# EAGLE design ATEM GPI-Tally Breakout Board (EAGLE 6.1)
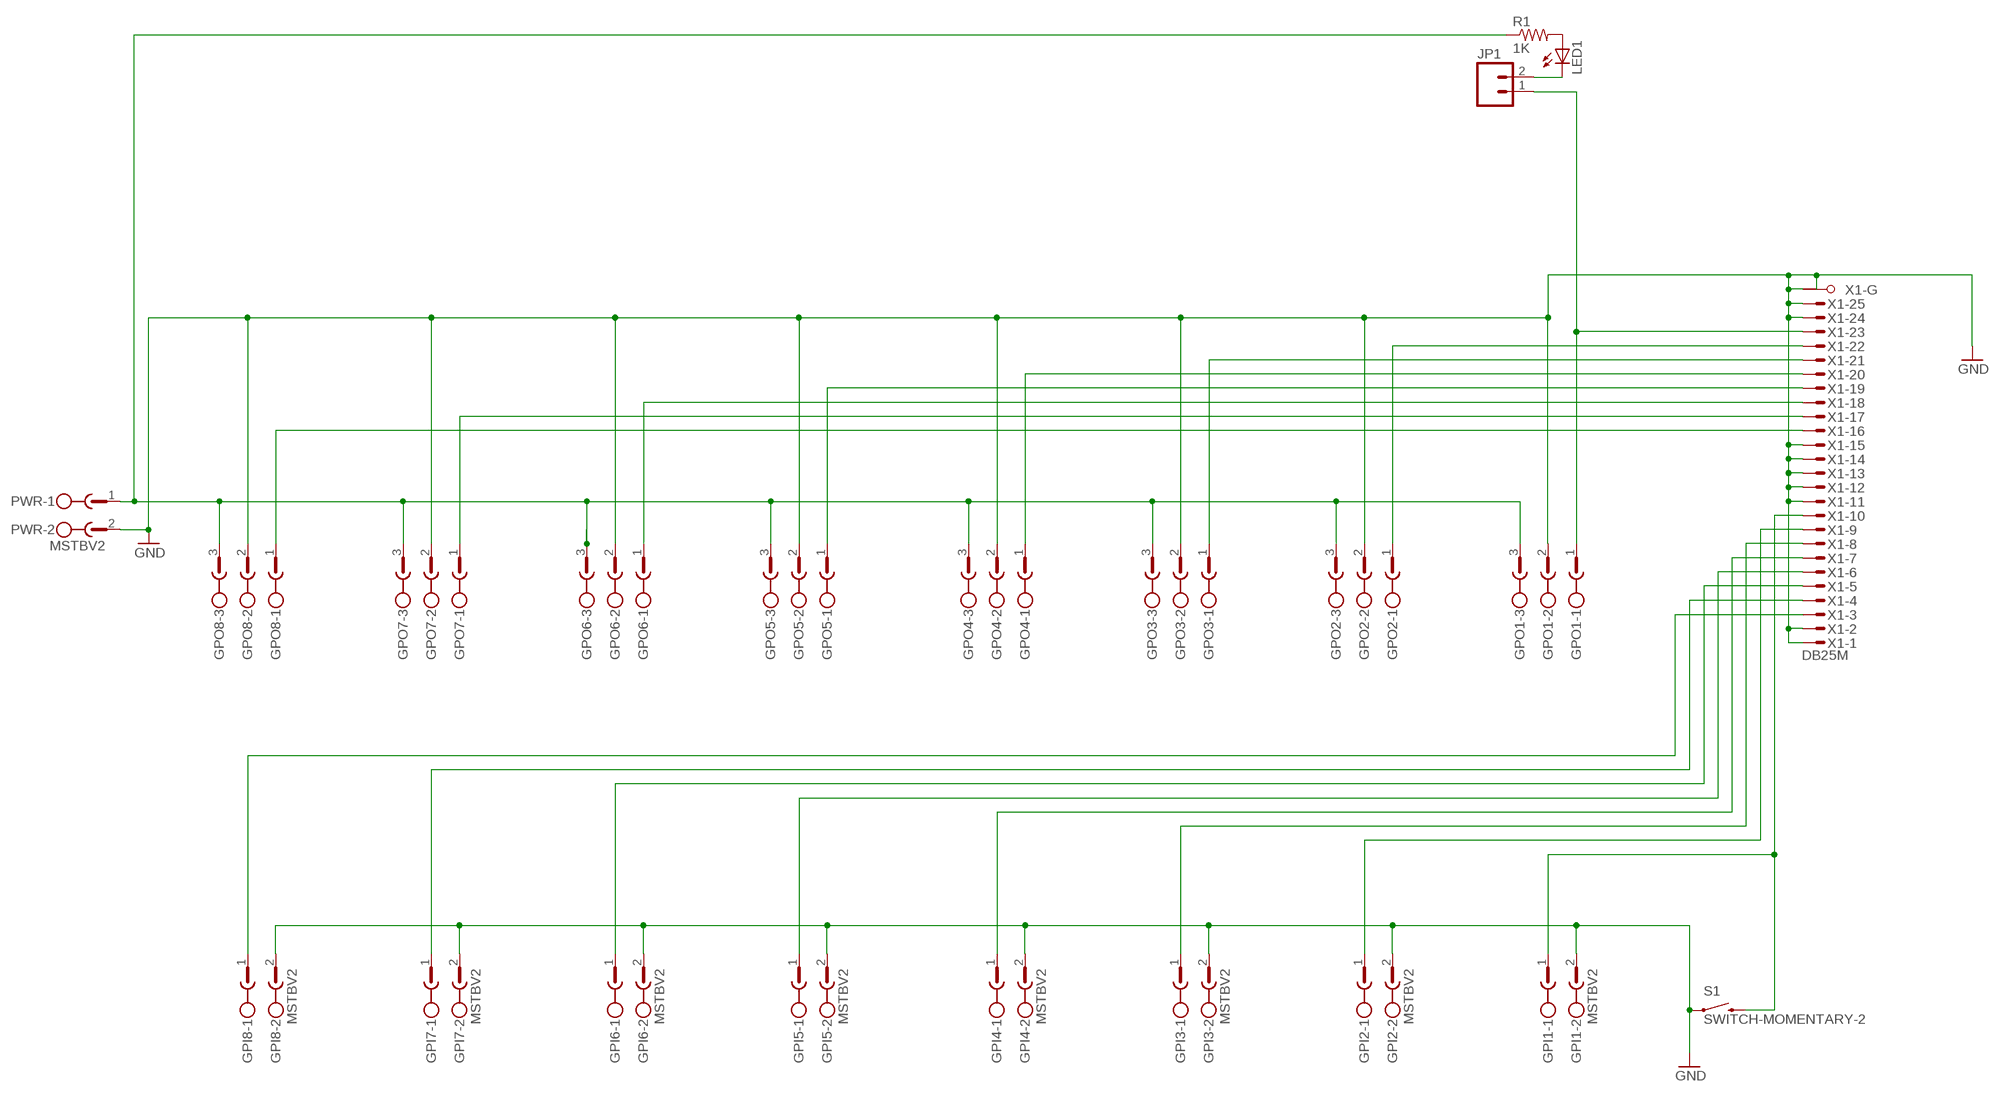
[diagram p0: schematic, sheet 1]

## Parts
GPI1  MSTBV2  [MSTBV2]
GPI2  MSTBV2  [MSTBV2]
GPI3  MSTBV2  [MSTBV2]
GPI4  MSTBV2  [MSTBV2]
GPI5  MSTBV2  [MSTBV2]
GPI6  MSTBV2  [MSTBV2]
GPI7  MSTBV2  [MSTBV2]
GPI8  MSTBV2  [MSTBV2]
GPO1  CON1  MSTBV3  [MSTBV3]
GPO2  CON1  MSTBV3  [MSTBV3]
GPO3  CON1  MSTBV3  [MSTBV3]
GPO4  CON1  MSTBV3  [MSTBV3]
GPO5  CON1  MSTBV3  [MSTBV3]
GPO6  CON1  MSTBV3  [MSTBV3]
GPO7  CON1  MSTBV3  [MSTBV3]
GPO8  CON1  MSTBV3  [MSTBV3]
JP1  M02LOCK  [1X02_LOCK]
LED1  LED5MM  [LED5MM]
PWR  MSTBV2  [MSTBV2]
R1  1K  RESISTORPTH-1/4W  [AXIAL-0.4]
S1  SWITCH-MOMENTARY-2  [TACTILE_SWITCH_TALL]
X1  DB25M  M25HPS  [M25HP]

## Nets
GND [PWR]: GPI1.2 GPI2.2 GPI3.2 GPI4.2 GPI5.2 GPI6.2 GPI7.2 GPI8.2 GPO1.2 GPO2.2 GPO3.2 GPO4.2 GPO5.2 GPO6.2 GPO7.2 GPO8.2 PWR.2 S1.A2 X1.1(-1:M) X1.2(-2:M) X1.11(-11:M) X1.12(-12:M) X1.13(-13:M) X1.14(-14:M) X1.15(-15:M) X1.24(-24:M) X1.25(-25:M) X1.G1(-G:G1) X1.G2(-G:G2)
N$1 [RELAY LINES]: GPO1.1 JP1.1 X1.23(-23:M)
N$2: JP1.2 LED1.K(C)
N$3: LED1.A R1.P$2
N$6 [RELAY LINES]: GPO2.1 X1.22(-22:M)
N$10 [RELAY LINES]: GPO3.1 X1.21(-21:M)
N$14 [RELAY LINES]: GPO4.1 X1.20(-20:M)
N$18 [RELAY LINES]: GPO5.1 X1.19(-19:M)
N$22 [RELAY LINES]: GPO6.1 X1.18(-18:M)
N$26 [RELAY LINES]: GPO7.1 X1.17(-17:M)
N$30 [RELAY LINES]: GPO8.1 X1.16(-16:M)
N$49 [INput lines]: GPI1.1 S1.B2 X1.10(-10:M)
N$55 [INput lines]: GPI5.1 X1.6(-6:M)
N$60 [INput lines]: GPI2.1 X1.9(-9:M)
N$61 [INput lines]: GPI3.1 X1.8(-8:M)
N$62 [INput lines]: GPI4.1 X1.7(-7:M)
N$64 [INput lines]: GPI6.1 X1.5(-5:M)
N$65 [INput lines]: GPI7.1 X1.4(-4:M)
N$66 [INput lines]: GPI8.1 X1.3(-3:M)
N$75 [RELAY LINES]: GPO1.3 GPO2.3 GPO3.3 GPO4.3 GPO5.3 GPO6.3 GPO7.3 GPO8.3 PWR.1 R1.P$1

## Library data of the parts
GPI1-GPI8 PWR = con-phoenix-508:MSTBV2: PHOENIX; MPN: MSTBV 2,5/2-GF-5.08; OC_FARNELL: 1792792; OC_NEWARK: 69R9845
GPO1-GPO8 = con-phoenix-508:MSTBV3: PHOENIX; MPN: MSTBV 2,5/3-GF-5.08; OC_FARNELL: 1792793; OC_NEWARK: 69R9846
JP1 = SparkFun:M02: Header 2 Standard 2-pin 0.1" header. Use with straight break away headers (SKU : PRT-00116), right angle break away headers (PRT-00553), swiss pins (PRT-00743), machine pins (PRT-00117), and female headers (PRT-00115). Molex polarized connector foot print use with SKU : PRT-08233 with associated crimp pins and housings.
LED1 = SparkFun:LED: LEDs Standard schematic elements and footprints for 5mm, 3mm, 1206, and 0603 sized LEDs. 5mm - Spark Fun Electronics SKU : COM-00529 (and others)
R1 = SparkFun:RESISTOR: Resistor Basic schematic elements and footprints for 0603, 1206, and PTH resistors.
S1 = SparkFun:SWITCH-MOMENTARY-2
X1 = con-subd:M25HPS: SUB-D; OC_FARNELL: unknown; OC_NEWARK: unknown

## Net classes
1 PWR: width 0.406 mm, clearance 0.254 mm
2 RELAY LINES: width 0.406 mm, clearance 0.254 mm
3 INput lines: clearance 0.254 mm

## Board
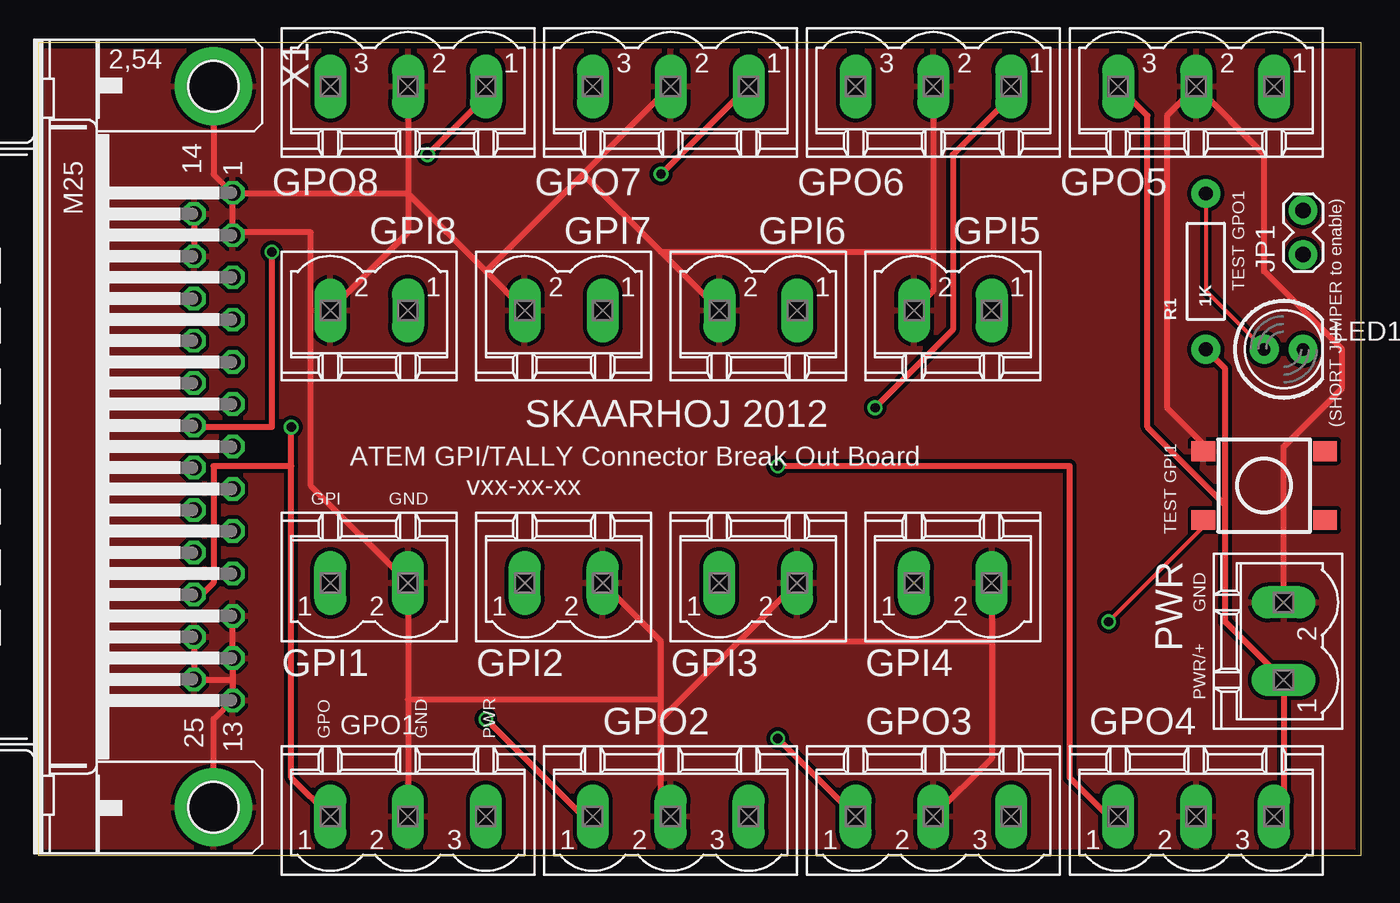
[diagram p1: board, top side]
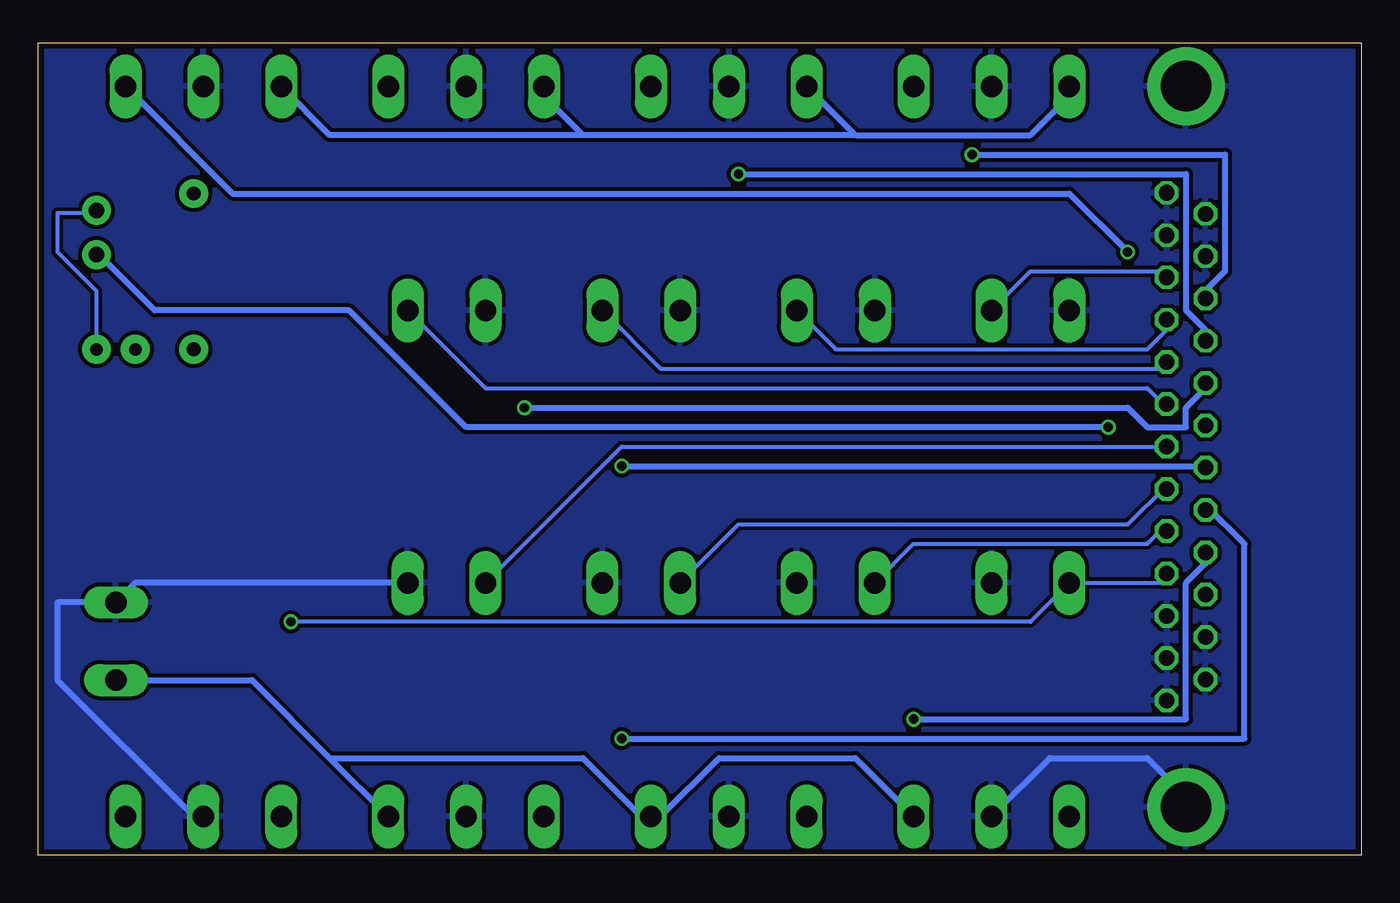
[diagram p2: board, bottom side, seen from below]

Size 86.34 x 53.01 mm. Coordinates in mm from the lower left corner, seen from the top.
Outline: 0,0 86.34,0 86.34,53.01 0,53.01 0,0
Copper layers (1*16): Top 0.0356mm / dielectric 1.5011mm / Bottom 0.0356mm
Design rules: minimum track width 6mil, minimum drill 13mil, track to track 6mil, track to pad 6mil, pad to pad 6mil, via to via 6mil, smd to smd 6mil, copper to edge 15mil, drill to drill 6mil, minimum pad ring 7mil, minimum via ring 7mil, stop-mask expansion 4mil, vias tented up to drill 0mil, thermal gap 10mil

### Footprints (pad centres in the part's own frame; a part is rotated, then mirrored left to right if it is on the bottom)
MSTBV2 = drill 1.397 long: 1 -2.54,0; 2 2.54,0
MSTBV3 = drill 1.397 long: 1 -5.08,0; 2 0,0; 3 5.08,0
1X02_LOCK = drill 1.016 pad 1.88: 1 -0.178,0; 2 2.718,0
LED5MM = drill 0.813 pad 1.88: A -1.27,0; K 1.27,0
AXIAL-0.4 = drill 0.9 pad 1.88: P$1 -5.08,0; P$2 5.08,0
TACTILE_SWITCH_TALL = smd 1.55 x 1.3: A1 -3.975,-2.25; A2 3.975,-2.25; B1 -3.975,2.25; B2 3.975,2.25
M25HP = drill 1.016 octagon: 1 -16.561,1.27; 2 -13.792,1.27; 3 -11.049,1.27; 4 -8.28,1.27; 5 -5.512,1.27; 6 -2.769,1.27; 7 0,1.27; 8 2.769,1.27; 9 5.512,1.27; 10 8.28,1.27; 11 11.049,1.27; 12 13.792,1.27; 13 16.561,1.27; 14 -15.189,-1.27; 15 -12.421,-1.27; 16 -9.652,-1.27; 17 -6.909,-1.27; 18 -4.14,-1.27; 19 -1.372,-1.27; 20 1.372,-1.27; 21 4.14,-1.27; 22 6.909,-1.27; 23 9.652,-1.27; 24 12.421,-1.27; 25 15.189,-1.27 | drill 3.302 pad 5.08: G1 -23.52,0; G2 23.52,0

### Placement (x,y rotation side)
GPI1  21.59,17.78 0 top
GPI2  34.29,17.78 0 top
GPI3  46.99,17.78 0 top
GPI4  59.69,17.78 0 top
GPI5  59.69,35.56 180 top
GPI6  46.99,35.56 180 top
GPI7  34.29,35.56 180 top
GPI8  21.59,35.56 180 top
GPO1  24.13,2.54 0 top
GPO2  41.27,2.54 0 top
GPO3  58.42,2.54 0 top
GPO4  75.56,2.54 0 top
GPO5  75.56,50.16 180 top
GPO6  58.42,50.16 180 top
GPO7  41.27,50.16 180 top
GPO8  24.13,50.16 180 top
JP1  82.55,39.37 90 top
LED1  81.28,33.02 0 top
PWR  81.28,13.97 90 top
R1  76.2,38.1 90 top
S1  80.01,24.13 180 top
X1  11.43,26.67 270 top

### Tracks (layer width: path | path; a pad name or v marks a point on that pad's centre or on a via)
GND
  Top 0.406: 10.16,40.64 X1.14 10.16,41.91 | 10.16,40.64 X1.15 | 10.16,40.64 12.7,40.64 | 12.7,40.64 12.7,43.18 | 12.7,43.18 11.43,44.45 X1.G1 | GPI5.2 58.42,36.83 58.42,39.37 | GPO6.2 58.42,39.37 | GPI8.2 24.13,40.64 24.13,43.18 | GPO8.2 24.13,43.18 | 24.13,43.18 29.21,38.1 | 29.21,38.1 GPI7.2 | 29.21,38.1 35.56,44.45 | 35.56,44.45 GPO7.2 | 35.56,44.45 40.64,39.37 | 40.64,39.37 GPI6.2 | 40.64,39.37 58.42,39.37 | 24.13,43.18 12.7,43.18 | 12.7,43.18 X1.1 | X1.24 X1.25 10.16,11.43 12.7,11.43 | 12.7,11.43 12.7,12.7 X1.12 X1.11 | 12.7,11.43 12.7,10.16 | 12.7,10.16 11.43,8.89 X1.G2 | 12.7,10.16 X1.13 | S1.A2 76.2,26.67 73.66,29.21 73.66,48.26 GPO5.2 80.01,45.72 80.01,38.1 85.09,33.02 85.09,30.48 81.28,26.67 PWR.2 | GPO3.2 62.23,6.35 62.23,13.97 | GPI4.2 62.23,13.97 | 24.13,10.16 GPI1.2 17.78,24.13 17.78,40.64 12.7,40.64 | 24.13,10.16 GPO1.2 | GPI2.2 40.64,13.97 40.64,10.16 | 40.64,8.89 40.64,2.54 GPO2.2 | 40.64,8.89 40.64,10.16 | 40.64,8.89 45.72,13.97 | 45.72,13.97 GPI3.2 | 40.64,10.16 24.13,10.16 | 45.72,13.97 62.23,13.97 | 12.7,40.64 X1.2
  Bottom 0.406: GPO4.2 76.2,2.54 85.09,11.43 85.09,16.51 PWR.2 80.01,17.78 GPI4.2 | GPO1.2 20.32,6.35 13.97,6.35 11.43,3.81 X1.G2
  pour Bottom: 0,53.34 0,0 86.36,0 86.36,53.34
  pour Top: 0,53.34 0,0 86.36,0 86.36,53.34
N$1  (via drill 0.61)
  Top 0.406: 16.51,25.4 11.43,25.4 11.43,17.78 10.16,16.51 X1.23 | 16.51,25.4 16.51,5.08 GPO1.1 | 16.51,25.4 v16.51,27.94
  Bottom 0.406: v16.51,27.94 58.42,27.94 66.04,35.56 78.74,35.56 82.55,39.37 JP1.1
N$2
  Bottom 0.254: LED1.K 82.55,36.83 85.09,39.37 85.09,41.91 82.55,41.91 JP1.2
N$3
  Top 0.254: LED1.A 76.2,36.83 R1.P$2
N$6  (via drill 0.61)
  Top 0.406: v29.21,8.89 35.56,2.54 GPO2.1
  Bottom 0.406: v29.21,8.89 11.43,8.89 11.43,17.78 10.16,19.05 X1.22
N$10  (via drill 0.61)
  Top 0.406: GPO3.1 v48.26,7.62
  Bottom 0.406: v48.26,7.62 7.62,7.62 7.62,20.32 10.16,22.86 X1.21
N$14  (via drill 0.61)
  Top 0.406: v48.26,25.4 67.31,25.4 67.31,5.08 69.85,2.54 GPO4.1
  Bottom 0.406: v48.26,25.4 10.16,25.4 X1.20
N$18  (via drill 0.61)
  Top 0.406: v15.24,39.37 15.24,27.94 10.16,27.94 X1.19
  Bottom 0.406: v15.24,39.37 19.05,43.18 73.66,43.18 GPO5.1
N$22  (via drill 0.61)
  Top 0.406: v54.61,29.21 59.69,34.29 59.69,45.72 63.5,49.53 GPO6.1
  Bottom 0.406: v54.61,29.21 15.24,29.21 13.97,27.94 11.43,27.94 11.43,29.21 10.16,30.48 X1.18
N$26  (via drill 0.61)
  Top 0.406: GPO7.1 v40.64,44.45
  Bottom 0.406: v40.64,44.45 11.43,44.45 11.43,35.56 10.16,34.29 X1.17
N$30  (via drill 0.61)
  Top 0.406: v25.4,45.72 29.21,49.53 GPO8.1
  Bottom 0.406: v25.4,45.72 8.89,45.72 8.89,38.1 10.16,36.83 X1.16
N$49  (via drill 0.61)
  Top 0.254: v69.85,15.24 76.2,21.59 S1.B2
  Bottom 0.254: v69.85,15.24 21.59,15.24 GPI1.1 12.7,17.78 X1.10
N$55
  Bottom 0.254: GPI5.1 57.15,30.48 13.97,30.48 12.7,29.21 X1.6
N$60
  Bottom 0.254: GPI2.1 29.21,20.32 13.97,20.32 12.7,21.59 X1.9
N$61
  Bottom 0.254: GPI3.1 40.64,21.59 15.24,21.59 12.7,24.13 X1.8
N$62
  Bottom 0.254: X1.7 48.26,26.67 GPI4.1
N$64
  Bottom 0.254: GPI6.1 45.72,31.75 12.7,31.75 X1.5
N$65
  Bottom 0.254: GPI7.1 34.29,33.02 13.97,33.02 12.7,34.29 X1.4
N$66
  Bottom 0.254: GPI8.1 21.59,38.1 12.7,38.1 X1.3
N$75
  Top 0.406: R1.P$1 77.47,31.75 77.47,22.86 | 77.47,22.86 77.47,15.24 PWR.1 81.28,2.54 GPO4.3 | GPO5.3 72.39,48.26 72.39,27.94 77.47,22.86
  Bottom 0.406: 33.02,46.99 21.59,46.99 19.05,49.53 GPO8.3 | GPO7.3 33.02,46.99 | 50.8,46.99 53.34,49.53 GPO6.3 | 33.02,46.99 50.8,46.99 | GPO5.3 67.31,46.99 50.8,46.99 | GPO1.3 33.02,6.35 41.91,6.35 45.72,2.54 GPO2.3 46.99,2.54 50.8,6.35 67.31,6.35 | 67.31,6.35 72.39,11.43 PWR.1 | 67.31,6.35 GPO3.3

### Text on the board
_tsilk: TEST GPO1 | SKAARHOJ 2012 | (SHORT JUMPER to enable) | ATEM GPI/TALLY Connector Break Out Board | GPI | GND | vxx-xx-xx | TEST GPI1 | GND | PWR/+ | GPO | GND | PWR